# EAGLE design Controller-Modul_1 (EAGLE 7.5.0)
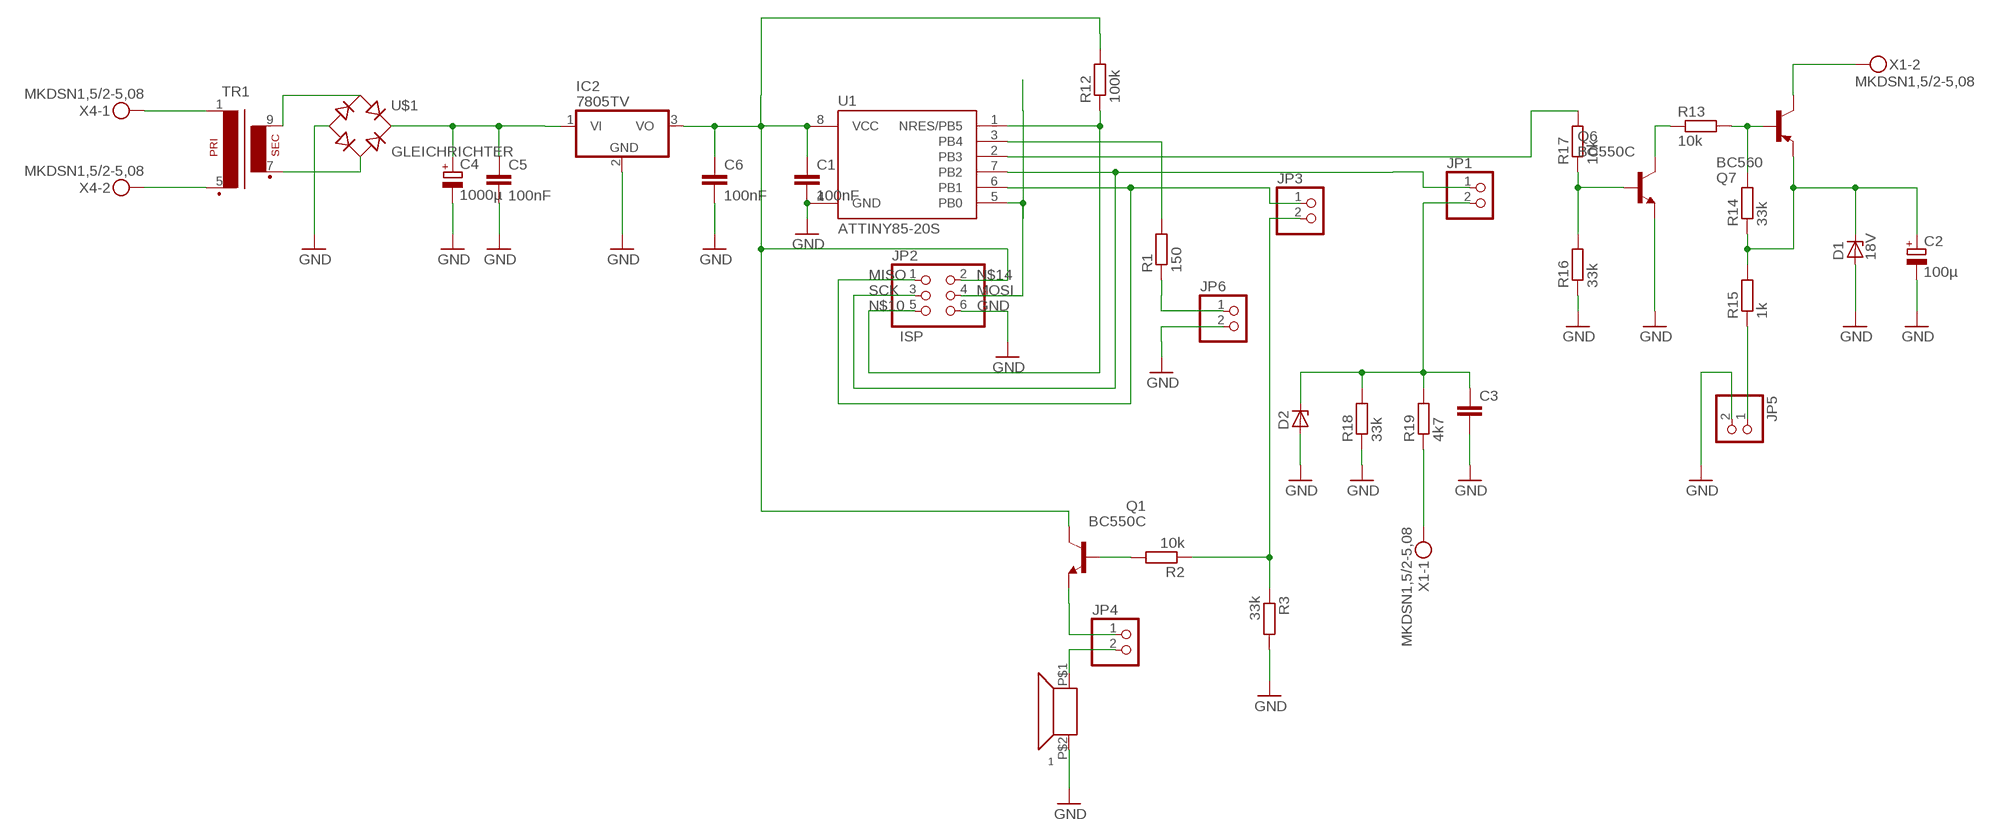
[diagram p0: schematic, sheet 1]

## Parts
1  SUMMER4  [PIEZO-INDIKATOR-KPMG]
C1  100nF  C-EUC0805  [C0805]
C2  100µ  CPOL-EUE2.5-7  [E2,5-7]
C3  C-EUC0603K  [C0603K]
C4  1000µ  CPOL-EUE3.5-8  [E3,5-8]
C5  100nF  C-EUC0805  [C0805]
C6  100nF  C-EUC0805  [C0805]
D1  18V  ZENER-DIODESOD80C  [SOD80C]
D2  ZENER-DIODESOT23  [SOT23]
IC2  7805TV  [TO220V]
JP1  PINHD-1X2  [1X02]
JP2  PINHD-2X3  [2X03]
JP3  PINHD-1X2  [1X02]
JP4  PINHD-1X2  [1X02]
JP5  PINHD-1X2  [1X02]
JP6  PINHD-1X2  [1X02]
Q1  BC550C  [TO92-EBC]
Q6  BC550C  [TO92-EBC]
Q7  BC560  [TO92-EBC]
R1  150  R-EU_R1206  [R1206]
R2  10k  R-EU_R1206  [R1206]
R3  33k  R-EU_R1206  [R1206]
R12  100k  R-EU_R1206  [R1206]
R13  10k  R-EU_R1206  [R1206]
R14  33k  R-EU_R1206  [R1206]
R15  1k  R-EU_R1206  [R1206]
R16  33k  R-EU_R1206  [R1206]
R17  10k  R-EU_R1206  [R1206]
R18  33k  R-EU_R1206  [R1206]
R19  4k7  R-EU_R1206  [R1206]
TR1  EI38-1  [EI38-1]
U1  ATTINY85-20S  [SOIC8_EIAJ_208MIL]
U$1  GLEICHRICHTER  [KBPC1]
X1  MKDSN1,5/2-5,08  [MKDSN1,5/2-5,08]
X4  MKDSN1,5/2-5,08  [MKDSN1,5/2-5,08]

## Nets
GND: 1.P$2(+) C1.2 C2.- C3.2 C4.- C5.2 C6.2 D1.A D2.1(A) IC2.2(GND) JP2.6 JP5.2 JP6.2 Q6.E R3.2 R16.1 R18.1 U1.4(GND) U$1.-
MISO: JP2.1 JP3.1 U1.6(PB1)
MOSI: JP2.4 U1.5(PB0)
N$1: Q7.B R13.2 R14.2
N$2: C3.1 D2.3(C) JP1.2 R18.2 R19.2
N$3: Q6.B R16.2 R17.1
N$4: Q1.B R2.2
N$5: Q6.C R13.1
N$6: JP6.1 R1.1
N$7: R19.1 X1.1
N$8: C2.+ D1.C Q7.E R14.1 R15.2
N$9: JP3.2 R2.1 R3.1
N$10: JP2.5 R12.1 U1.1(NRES/PB5)
N$11: JP4.1 Q1.E
N$12: R1.2 U1.3(PB4)
N$13: 1.P$1(-) JP4.2
N$14: C1.1 C6.1 IC2.3(VO) JP2.2 Q1.C R12.2 U1.8(VCC)
N$15: JP5.1 R15.1
N$17: C4.+ C5.1 IC2.1(VI) U$1.+
N$18: Q7.C X1.2
N$19: TR1.1 X4.1
N$20: TR1.5(P2) X4.2
N$21: TR1.7(S3) U$1.AC2
N$22: TR1.9(S4) U$1.AC1
N$23: R17.2 U1.2(PB3)
SCK: JP1.1 JP2.3 U1.7(PB2)

## Notes on the sheet
- ISP

## Library data of the parts
1 = 0liver:SUMMER: SUMMER BS 27HS :: Piezosummer https://www.reichelt.de/Signalakustik/SUMMER-BS-27HS/3/index.html?&ACTION=3&LA=446&GROUPID=6560&ARTICLE=35922
C1 C3 C5 C6 = rcl:C-EU: CAPACITOR, European symbol
C2 = resistor:CPOL-EU: POLARIZED CAPACITOR, European symbol
C4 = rcl:CPOL-EU: POLARIZED CAPACITOR, European symbol
D1 D2 = diode:ZENER-DIODE: Z-Diode
IC2 = linear:78*: Positive VOLTAGE REGULATOR Source: http://cache.national.com/ds/LM/LM78L05.pdf http://www.fairchildsemi.com/ds/LM/LM7805.pdf
JP1 JP3-JP6 = pinhead:PINHD-1X2: PIN HEADER
JP2 = pinhead:PINHD-2X3: PIN HEADER
Q1 Q6 = transistor-npn:BC550*: NPN Transistor
Q7 = transistor-pnp:BC560*: PNP Transistror
R1 R12 = rcl:R-EU_: RESISTOR, European symbol
R2 R3 R13-R19 = resistor:R-EU_: RESISTOR, European symbol
TR1 = trafo:EI38-1: TRANSFORMER 1 primary winding, 1 secondary winding ERA
U1 = _hhn_attiny25_45_85:ATTINY85*: ATMEL ATtiny 85 Packages: P = PDIP 08 30mil S = SOIC 08 EIAJ 208mil Technologies Note: for complete ordering code (temp. range, finish, tape&reel etc.) see www.atmel.com • Supply Voltage: V = (1.8…5.5)V | [blank] = (2.7…5.5)V • Speed: 10 = 10 MHz | 20 = 20 MHz Author: Dipl.-Ing. FH Rainer Bayer HHN Hochschule Heilbronn (Heilbronn University), rainer.bayer@hs-heilbronn.de Ingenieurbüro ing-rb, mail@ing-rb.de
U$1 = Gleichrichter:GLEICHRICHTER
X1 X4 = con-phoenix-508:MKDSN1,5/2-5,08: MKDSN 1,5/ 2-5,08 Printklemme Nennstrom: 13,5 A Nennspannung: 250 V Rastermaß: 5,08 mm Polzahl: 2 Anschlussart: Schraubanschluss Montage: Löten Anschlussrichtung Leiter/Platine: 0 ° Artikelnummer: 1729128 Source: http://eshop.phoenixcontact.com .. 1729128.pdf

## Board
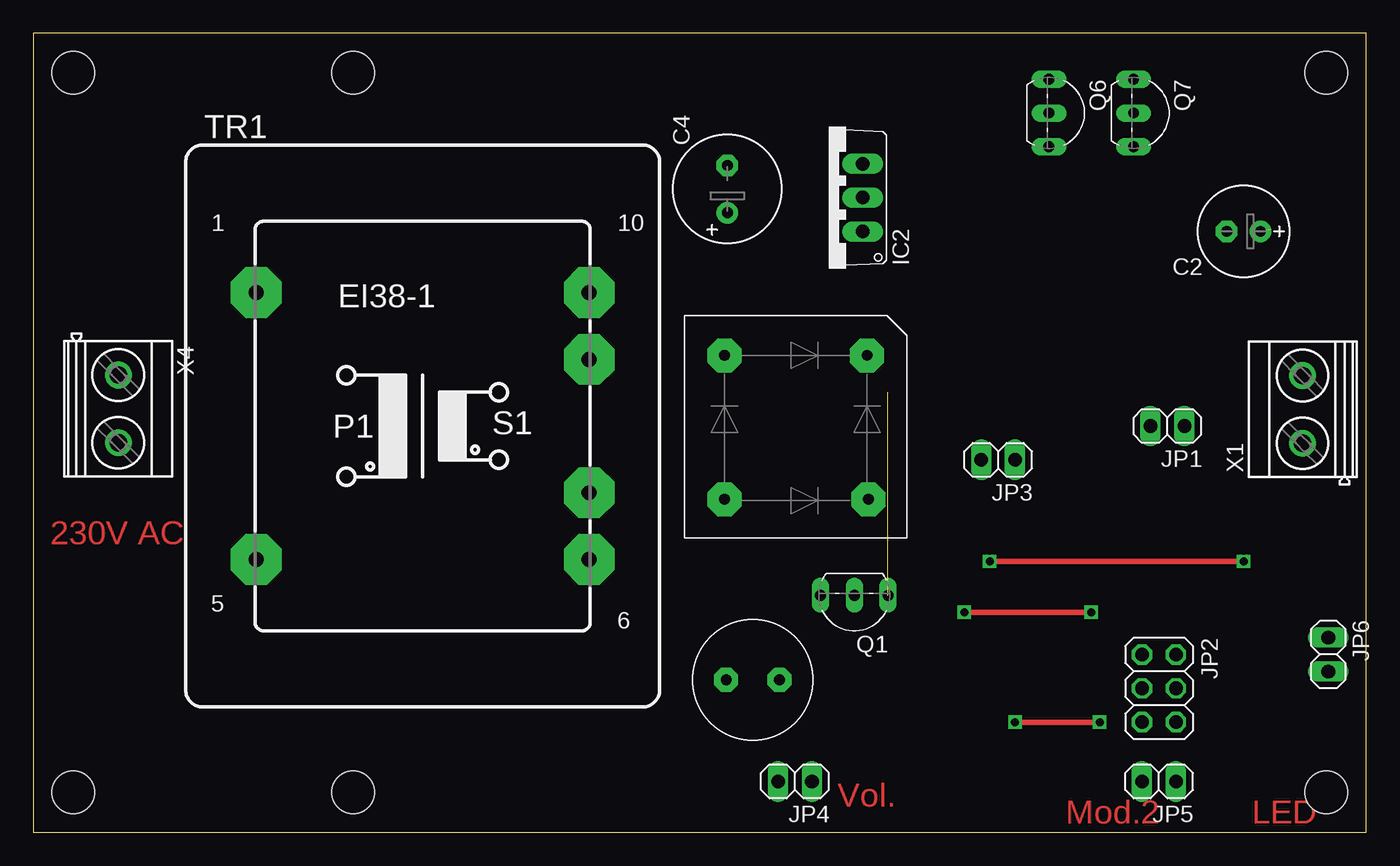
[diagram p1: board, top side]
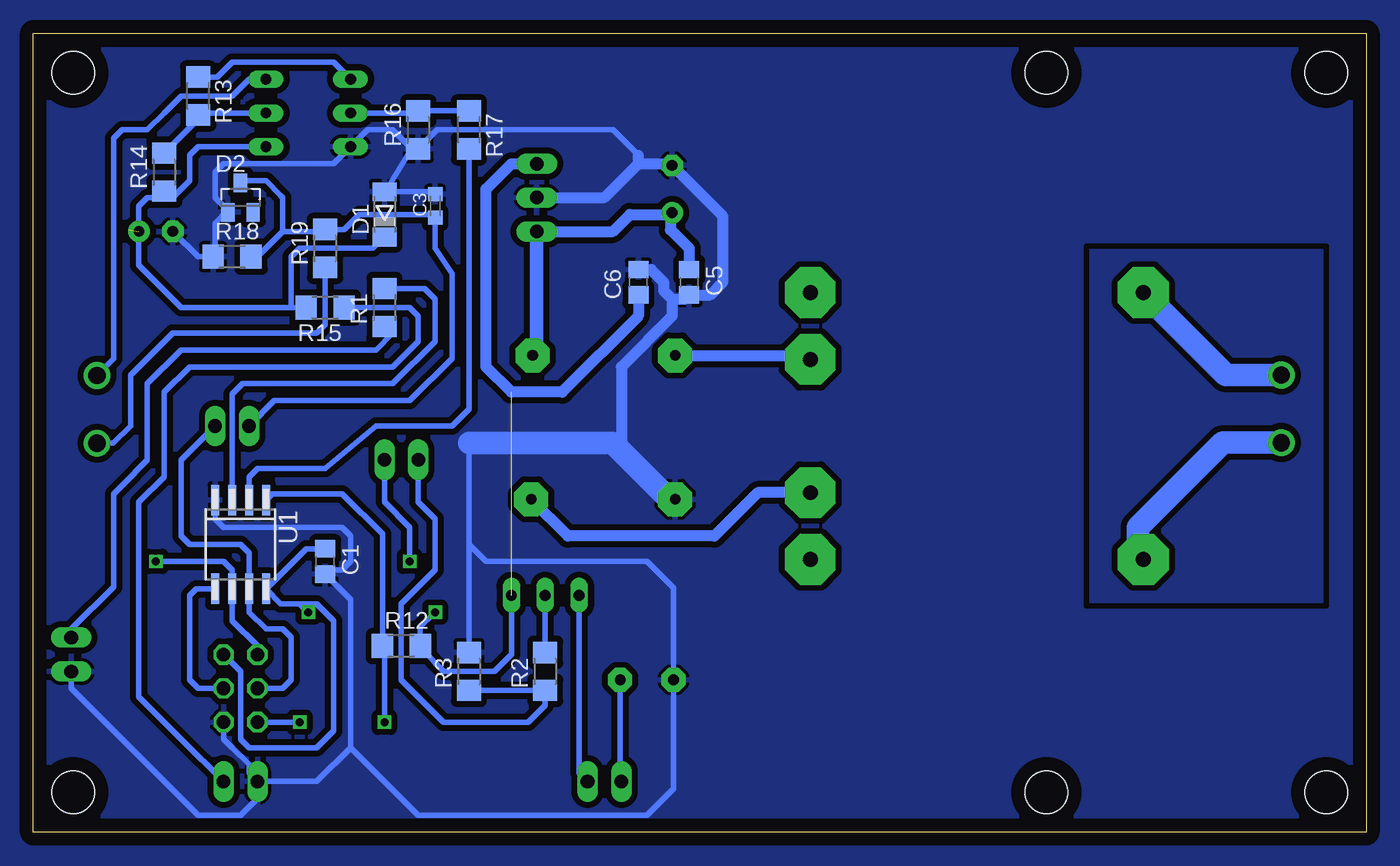
[diagram p2: board, bottom side, seen from below]

Size 100 x 59.95 mm. Coordinates in mm from the lower left corner, seen from the top.
Outline: 0,0 100,0 100,59.95 0,59.95 0,0
Copper layers (1*16): Top 0.035mm / dielectric 1.5mm / Bottom 0.035mm
Design rules "default *": minimum track width 10mil, minimum drill 24mil, track to track 18mil, track to pad 18mil, pad to pad 18mil, via to via 18mil, smd to smd 8mil, copper to edge 40mil, drill to drill 8mil, minimum pad ring 10mil, minimum via ring 8mil, stop-mask expansion 4mil, vias tented up to drill 0mil, thermal gap 10mil
Holes 3.2 mm at 3,3 24,3 24,57 3,57 97,3 97,57
bRestrict: 6 lines

### Footprints (pad centres in the part's own frame; a part is rotated, then mirrored left to right if it is on the bottom)
PIEZO-INDIKATOR-KPMG = drill 0.8 pad 1.778 octagon: P$1 2,0; P$2 -2,0
C0805 = smd 1.3 x 1.5: 1 -0.95,0; 2 0.95,0
E2,5-7 = drill 0.813 pad 1.6: + -1.27,0 | drill 0.813 pad 1.6 octagon: - 1.27,0
C0603K = smd 1.05 x 1.08: 1 -0.875,0; 2 0.875,0
E3,5-8 = drill 0.813 pad 1.6: + -1.778,0 | drill 0.813 pad 1.6 octagon: - 1.778,0
SOD80C = smd 1.4 x 1.8: A 1.7,0; C -1.7,0
SOT23 = smd 1 x 1.4: 1 -0.95,-1.1; 2 0.95,-1.1; 3 0,1.1
TO220V = drill 1.016 long: 1 -2.54,-2.54; 2 0,-2.54; 3 2.54,-2.54
1X02 = drill 1.016 long: 1 -1.27,0; 2 1.27,0
2X03 = drill 1.016 octagon: 1 -2.54,-1.27; 2 -2.54,1.27; 3 0,-1.27; 4 0,1.27; 5 2.54,-1.27; 6 2.54,1.27
TO92-EBC = drill 0.813 long: B 0,-1.27; C -2.54,-1.27; E 2.54,-1.27
R1206 = smd 1.6 x 1.803: 1 -1.422,0; 2 1.422,0
EI38-1 = drill 1.118 pad 3.81 octagon: 1 -12.497,10.008; 5 -12.497,-10.008; 6 12.497,-10.008; 7 12.497,-5.004; 9 12.497,5.004; 10 12.497,10.008
SOIC8_EIAJ_208MIL = smd 0.6 x 2.286: 1 -1.905,-3.33; 2 -0.635,-3.33; 3 0.635,-3.33; 4 1.905,-3.33; 5 1.905,3.33; 6 0.635,3.33; 7 -0.635,3.33; 8 -1.905,3.33
KBPC1 = drill 0.8 pad 2.54 octagon: + -5.3,5.4; - 5.5,-5.3; AC1 -5.3,-5.3; AC2 5.5,5.5
MKDSN1,5/2-5,08 = drill 1.3 pad 2: 1 -2.561,0.025; 2 2.519,0.025

### Placement (x,y rotation side)
1  53.98,11.43 0 top
C1  78.11,20.32 270 bottom
C2  90.81,45.09 180 top
C3  69.85,46.99 90 bottom
C4  52.07,48.26 90 top
C5  50.8,41.27 270 bottom
C6  54.61,41.27 90 bottom
D1  73.66,46.35 90 bottom
D2  84.45,47.62 0 bottom
IC2  59.69,47.62 90 top
JP1  85.09,30.48 180 top
JP2  84.45,10.79 270 top
JP3  72.39,27.94 180 top
JP4  57.15,3.81 180 top
JP5  84.45,3.81 180 top
JP6  97.16,13.34 270 top
Q1  61.59,16.51 180 top
Q6  77.47,53.98 270 top
Q7  83.82,53.98 270 top
R1  73.66,39.37 90 bottom
R2  61.59,12.06 90 bottom
R3  67.31,12.06 90 bottom
R12  72.39,13.97 0 bottom
R13  87.63,55.24 270 bottom
R14  90.17,49.53 90 bottom
R15  78.11,39.37 180 bottom
R16  71.12,52.7 90 bottom
R17  67.31,52.7 270 bottom
R18  85.09,43.18 0 bottom
R19  78.11,43.81 90 bottom
TR1  29.21,30.48 0 top
U1  84.45,21.59 180 bottom
U$1  57.15,30.48 270 top
X1  95.25,31.75 90 top
X4  6.35,31.75 270 top

### Tracks (layer width: path | path; a pad name or v marks a point on that pad's centre or on a via)
GND
  Bottom 0.406: 67.31,29.21 67.31,21.59 | 67.31,21.59 67.31,16.03 R3.2 | 67.31,21.59 66.04,20.32 53.98,20.32 51.98,18.32 1.P$2 51.98,3.27 53.98,1.27 71.12,1.27 76.2,6.35 | C3.2 70.04,48.05 D1.A 73.51,48.21 71.6,51.28 | 71.6,51.28 R16.1 69.7,52.7 69.22,52.7 56.52,52.7 54.61,50.8 | 71.6,51.28 73.03,52.7 74.93,52.7 Q6.E 77.47,50.16 85.72,50.16 86.36,49.53 86.36,47.62 85.41,46.67 D2.1 85.56,46.52 86.36,45.72 86.36,43.33 R18.1 87.63,43.18 C2.- | JP5.2 83.19,2.54 84.45,1.27 87.63,1.27 97.16,10.79 JP6.2 | 76.2,6.35 76.2,17.46 C1.2 77.79,19.68 76.83,19.68 76.2,20.32 76.2,22.23 76.83,22.86 85.72,22.86 86.36,23.5 U1.4 | 76.2,6.35 78.74,3.81 JP5.2 | JP2.6 85.72,6.99 85.09,6.35 83.82,5.08 83.82,4.45 JP5.2
  Bottom 0.813: 57.15,47.62 IC2.2 57.15,47.62 | 57.15,47.62 54.61,50.16 | 54.61,50.16 52.2,50.16 C4.- 48.26,46.23 48.26,41.27 49.21,40.33 C5.2 51.12,40.01 52.07,40.01 | C6.2 53.66,42.23 52.7,41.27 52.7,40.64 52.07,40.01 | 57.15,47.62 54.61,50.16 | 54.61,50.16 54.61,50.8 | 52.07,40.01 52.07,38.73 55.88,34.92 55.88,29.01 U$1.-
  Bottom 1.676: U$1.- 52.28,24.98 56.52,29.21 67.31,29.21
  pour Bottom: -3.17,-3.17 103.5,-3.17 103.5,65.41 -3.17,65.41
MISO  (via drill 0.6)
  Top 0.406: v90.81,20.32 v71.75,20.32
  Bottom 0.406: JP2.1 83.19,13.97 85.09,15.88 U1.6 85.09,19.68 85.72,20.32 v90.81,20.32 | v71.75,20.32 71.75,22.86 73.66,24.77 JP3.1
MOSI
  Bottom 0.406: JP2.4 87.63,10.79 88.27,11.43 88.27,12.7 88.27,17.78 87.78,18.26 U1.5
N$1
  Bottom 0.406: Q7.B 87.48,53.98 R13.2 87.63,53.49 R14.2
N$2
  Bottom 0.406: D2.3 84.28,48.9 82.55,48.9 81.43,47.78 81.28,47.62 81.28,45.09 | R18.2 83.19,43.18 81.28,45.09 | 81.28,45.09 78.26,45.09 R19.2 76.68,45.24 75.56,46.35 70.09,46.35 C3.1 69.85,43.81 68.58,41.91 68.58,35.56 71.75,32.38 81.92,32.38 JP1.2
N$3
  Bottom 0.406: Q6.B 71.12,53.98 R16.2 R17.1
N$4
  Bottom 0.406: Q1.B R2.2
N$5
  Bottom 0.406: R13.1 86.21,56.67 85.09,57.78 77.47,57.78 Q6.C
N$6
  Bottom 0.406: R1.1 74.14,37.47 73.03,37.47 74.3,36.2 88.9,36.2 91.44,33.66 91.44,32.38 91.44,27.94 93.34,26.04 93.98,25.4 93.98,18.41 97.16,15.24 JP6.1
N$7
  Bottom 0.406: X1.1 94,29.19 92.71,30.48 92.71,34.29 90.81,36.2 89.53,37.47 82.55,37.47 78.74,37.47 78.11,38.1 R19.1
N$8  (1 unrouted)
  Bottom 0.406: Q7.E 84.45,51.44 87.63,51.44 88.27,50.8 88.27,48.9 89.53,47.62 89.69,47.62 | 80.64,39.37 88.9,39.37 91.44,41.91 92.08,42.55 C2.+ 92.08,46.99 91.44,47.62 89.69,47.62 | 80.64,39.37 R15.2 80.64,39.37 | D1.C 74.5,43.81 80.01,43.81 80.64,43.18 80.64,39.37 | 89.69,47.62 R14.1
N$9
  Bottom 0.406: R3.1 R2.1 61.59,9.53 62.87,8.26 69.22,8.26 69.85,8.89 72.39,11.43 72.39,17.14 69.85,19.68 69.85,23.5 71.12,24.77 71.12,25.4 JP3.2
N$10  (via drill 0.6)
  Top 0.406: v80.01,8.26 v73.66,8.26
  Bottom 0.406: JP2.5 v80.01,8.26 | v73.66,8.26 73.66,13.82 R12.1 73.81,22.38 76.83,25.4 82.07,25.4 U1.1
N$11
  Bottom 0.406: Q1.E 59.05,4.45 JP4.1
N$12
  Bottom 0.406: U1.3 85.09,32.87 84.94,33.02 84.3,33.66 73.03,33.66 69.85,36.83 69.85,40.01 70.64,40.79 R1.2
N$13
  Bottom 0.406: 1.P$1 55.98,3.9 JP4.2
N$14  (via drill 0.6)  (1 unrouted)
  Top 0.406: v69.85,16.51 v79.38,16.51
  Bottom 0.406: Q1.C 64.14,13.34 65.41,12.06 69.22,12.06 69.85,12.7 R12.2 70.97,15.39 v69.85,16.51 | C1.1 79.54,21.27 U1.8 81.44,17.14 80.64,17.14 80.01,17.14 | JP2.2 84.45,12.06 84.45,6.99 83.82,6.35 78.74,6.35 77.47,7.62 77.47,15.88 78.74,17.14 80.01,17.14 | v79.38,16.51 80.01,17.14
  Bottom 0.813: C6.1 54.61,38.73 60.33,33.02 64.14,33.02 66.04,34.92 66.04,48.26 64.14,50.16 IC2.3
N$15
  Bottom 0.406: 85.72,5.08 JP5.1 88.9,6.99 90.81,8.89 92.08,10.16 92.08,24.77 90.17,26.67 90.17,27.3 90.17,29.84 90.17,33.02 88.27,34.92 73.03,34.92 72.39,35.56 71.12,36.83 71.12,38.73 71.75,39.37 72.39,39.37 74.93,39.37 76.83,39.37 76.68,39.52 R15.1
N$16
  pour Bottom: -5.71,66.67 106.05,66.67 106.05,-5.08 -5.71,-5.08
N$17
  Bottom 0.813: IC2.1 56.52,45.09 55.24,46.35 52.2,46.35 | 52.2,46.35 C4.+ | 52.2,46.35 52.2,45.21 50.8,43.81 C5.1
  Bottom 1.016: IC2.1 62.23,36.1 U$1.+
N$18
  Bottom 0.406: X1.2 93.98,35.56 93.98,43.18 93.98,52.07 93.34,52.7 91.44,52.7 90.17,53.98 88.9,55.24 85.09,55.24 83.82,56.52 Q7.C
N$19
  Bottom 1.676: X4.1 10.54,34.31 TR1.1
N$20
  Bottom 1.676: X4.2 10.77,29.23 14.61,25.4 17.14,22.86 17.14,20.32 | 17.14,20.32 16.51,19.68 17.14,20.32 | 17.14,20.32 16.87,20.32 TR1.5
N$21
  Bottom 0.813: TR1.7 45.64,25.48 48.9,22.23 59.9,22.23 U$1.AC2
N$22
  Bottom 0.813: U$1.AC1 42,35.78 TR1.9
N$23
  Bottom 0.406: R17.2 67.31,50.16 67.31,48.26 67.31,31.75 68.58,30.48 71.12,30.48 74.3,30.48 78.11,27.3 80.64,27.3 81.92,27.3 83.19,27.3 83.82,26.67 U1.2
SCK
  Bottom 0.406: JP2.3 81.28,10.79 80.64,11.43 80.64,14.61 81.28,15.24 82.55,15.24 83.82,16.51 U1.7 83.82,20.95 84.45,21.59 88.27,21.59 88.9,22.23 88.9,27.94 JP1.1

### Text on the board
Top: 230V AC | Vol. | Mod.2 | LED